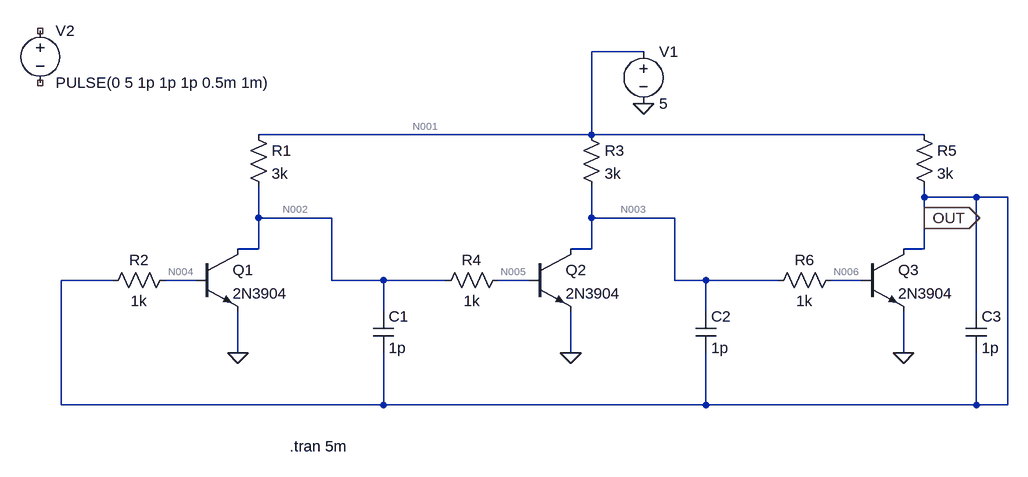
[diagram p0: schematic bjt nots.asc]
bjt nots.asc, the LTspice schematic file:
Version 4
SHEET 1 1352 680
WIRE 560 -272 480 -272
WIRE 480 -144 480 -272
WIRE 480 -144 -32 -144
WIRE 992 -144 480 -144
WIRE 992 -48 992 -64
WIRE 1072 -48 992 -48
WIRE 1120 -48 1072 -48
WIRE -32 -16 -32 -64
WIRE 80 -16 -32 -16
WIRE 480 -16 480 -64
WIRE 608 -16 480 -16
WIRE 992 -16 992 -48
WIRE -32 32 -32 -16
WIRE -32 32 -64 32
WIRE 480 32 480 -16
WIRE 480 32 448 32
WIRE 992 32 992 -16
WIRE 992 32 960 32
WIRE -256 80 -336 80
WIRE -128 80 -176 80
WIRE 80 80 80 -16
WIRE 160 80 80 80
WIRE 256 80 160 80
WIRE 384 80 336 80
WIRE 608 80 608 -16
WIRE 656 80 608 80
WIRE 768 80 656 80
WIRE 896 80 848 80
WIRE 160 128 160 80
WIRE 656 128 656 80
WIRE 1072 128 1072 -48
WIRE -64 192 -64 128
WIRE 448 192 448 128
WIRE 960 192 960 128
WIRE -336 272 -336 80
WIRE 160 272 160 192
WIRE 160 272 -336 272
WIRE 656 272 656 192
WIRE 656 272 160 272
WIRE 1072 272 1072 192
WIRE 1072 272 656 272
WIRE 1120 272 1120 -48
WIRE 1120 272 1072 272
FLAG -64 192 0
FLAG 448 192 0
FLAG 960 192 0
FLAG 560 -192 0
FLAG 992 -16 OUT
IOPIN 992 -16 Out
SYMBOL res -48 -160 R0
SYMATTR InstName R1
SYMATTR Value 3k
SYMBOL res -160 64 R90
WINDOW 0 0 56 VBottom 2
WINDOW 3 32 56 VTop 2
SYMATTR InstName R2
SYMATTR Value 1k
SYMBOL npn -128 32 R0
SYMATTR InstName Q1
SYMATTR Value 2N3904
SYMBOL res 464 -160 R0
SYMATTR InstName R3
SYMATTR Value 3k
SYMBOL res 352 64 R90
WINDOW 0 0 56 VBottom 2
WINDOW 3 32 56 VTop 2
SYMATTR InstName R4
SYMATTR Value 1k
SYMBOL npn 384 32 R0
SYMATTR InstName Q2
SYMATTR Value 2N3904
SYMBOL res 976 -160 R0
SYMATTR InstName R5
SYMATTR Value 3k
SYMBOL res 864 64 R90
WINDOW 0 0 56 VBottom 2
WINDOW 3 32 56 VTop 2
SYMATTR InstName R6
SYMATTR Value 1k
SYMBOL npn 896 32 R0
SYMATTR InstName Q3
SYMATTR Value 2N3904
SYMBOL voltage 560 -288 R0
SYMATTR InstName V1
SYMATTR Value 5
SYMBOL cap 144 128 R0
SYMATTR InstName C1
SYMATTR Value 1p
SYMBOL cap 640 128 R0
SYMATTR InstName C2
SYMATTR Value 1p
SYMBOL cap 1056 128 R0
SYMATTR InstName C3
SYMATTR Value 1p
SYMBOL voltage -368 -320 R0
WINDOW 123 0 0 Left 0
WINDOW 39 0 0 Left 0
SYMATTR InstName V2
SYMATTR Value PULSE(0 5 1p 1p 1p 0.5m 1m)
TEXT 16 336 Left 2 !.tran 5m

The netlist it stands for:
* bjt nots.asc
R1 N001 N002 3k
R2 N004 OUT 1k
Q1 N002 N004 0 0 2N3904
R3 N001 N003 3k
R4 N005 N002 1k
Q2 N003 N005 0 0 2N3904
R5 N001 OUT 3k
R6 N006 N003 1k
Q3 OUT N006 0 0 2N3904
V1 N001 0 5
C1 N002 OUT 1p
C2 N003 OUT 1p
C3 OUT OUT 1p
V2 NC_01 NC_02 PULSE(0 5 1p 1p 1p 0.5m 1m)
.model NPN NPN
.model PNP PNP
.lib standard.bjt
.tran 5m
.backanno
.end

* Results of the author's LTspice run, read from the files saved beside the schematic
* Operating Point, zero values left out:
*   V(n001) = 5 V
*   V(n002) = 669.7 mV
*   V(n004) = 664.9 mV
*   V(out) = 669.7 mV
*   V(n003) = 669.7 mV
*   V(n005) = 664.9 mV
*   V(n006) = 664.9 mV
*   Ic(Q3) = 1.439 mA
*   Ib(Q3) = 4.812 µA
*   Ie(Q3) = -1.443 mA
*   Ic(Q2) = 1.439 mA
*   Ib(Q2) = 4.812 µA
*   Ie(Q2) = -1.443 mA
*   Ic(Q1) = 1.439 mA
*   Ib(Q1) = 4.812 µA
*   Ie(Q1) = -1.443 mA
*   I(R6) = -4.812 µA
*   I(R5) = 1.443 mA
*   I(R4) = -4.812 µA
*   I(R3) = 1.443 mA
*   I(R2) = -4.812 µA
*   I(R1) = 1.443 mA
*   I(V1) = -4.33 mA